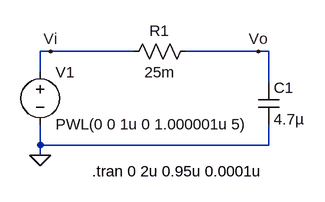
[diagram p0: schematic Inrush Current.asc]
Inrush Current.asc, the LTspice schematic file:
Version 4
SHEET 1 880 680
WIRE -80 112 -96 112
WIRE 48 112 -80 112
WIRE 240 112 128 112
WIRE 256 112 240 112
WIRE -96 144 -96 112
WIRE 256 160 256 112
WIRE -96 256 -96 224
WIRE 256 256 256 224
WIRE 256 256 -96 256
WIRE -96 272 -96 256
FLAG -96 272 0
FLAG -80 112 Vi
FLAG 240 112 Vo
SYMBOL res 32 128 R270
WINDOW 0 32 56 VTop 2
WINDOW 3 0 56 VBottom 2
SYMATTR InstName R1
SYMATTR Value 25m
SYMBOL cap 240 160 R0
SYMATTR InstName C1
SYMATTR Value 4.7µ
SYMBOL voltage -96 128 R0
WINDOW 123 0 0 Left 0
WINDOW 39 0 0 Left 0
SYMATTR InstName V1
SYMATTR Value PWL(0 0 1u 0 1.000001u 5)
TEXT -16 296 Left 2 !.tran 0 2u 0.95u 0.0001u

The netlist it stands for:
* Inrush Current.asc
R1 Vi Vo 25m
C1 Vo 0 4.7µ
V1 Vi 0 PWL(0 0 1u 0 1.000001u 5)
.tran 0 2u 0.95u 0.0001u
.backanno
.end

* Results of the author's LTspice run, read from the files saved beside the schematic
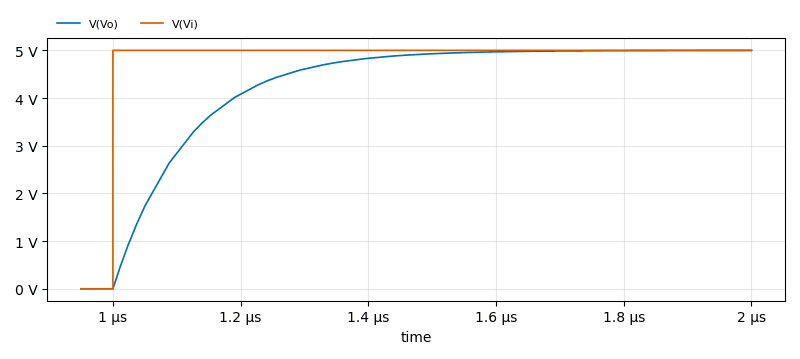
[diagram p1: Transient Analysis of Inrush Current.asc, plotted from the saved traces]
* Transient Analysis, 1 run:
*   V(Vo): min 0 V, max 4.999 V, average 4.2 V, rms 4.428 V, last 4.999 V
*   V(Vi): min 0 V, max 5 V, average 4.762 V, rms 4.879 V, last 5 V